# Altium schematic sheet JTAG.SchDoc
size A4
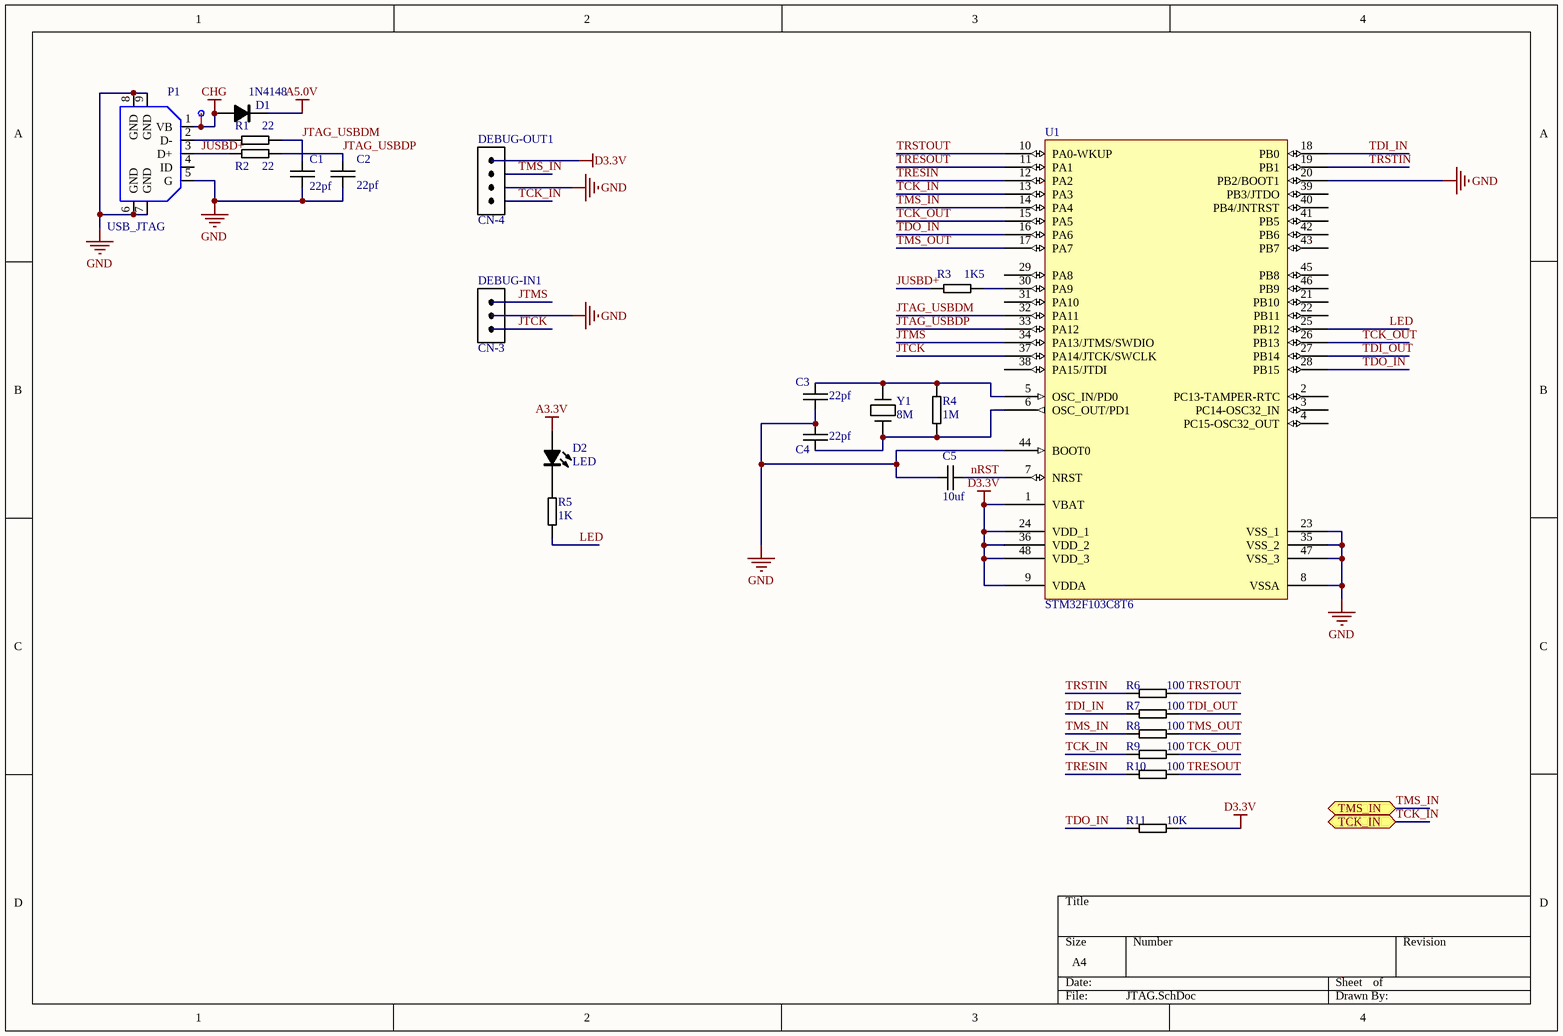
[diagram p0: JTAG.SchDoc]

## Parts
*1  Point  [Point]  (value not drawn)
C1  22pf  [0805-C]
C2  22pf  [0805-C]
C3  22pf  [0603]
C4  22pf  [0603]
C5  10uf  [0603]
D1  1N4148  [DO-35]
D2  LED  [0805-LED]
DEBUG-IN1  CN-3  [SIP-3]
DEBUG-OUT1  CN-4  [SIP-4]
P1  USB_JTAG  [USB_Mini_B]
R1  22  [0805-R]
R2  22  [0805-R]
R3  1K5  [0603]
R4  1M  [0603]
R5  1K  [0805-R]
R6  100  [0603]
R7  100  [0603]
R8  100  [0603]
R9  100  [0603]
R10  100  [0603]
R11  10K  [0603]
U1  STM32F103C8T6  [LQFP48_N]
Y1  8M  [XTAL(HC-49)]

## Ports
TCK_IN, TMS_IN

## Nets
A3.3V: D2.1(A)
A5.0V: D1.2(K)
CHG: *1.1(Point) D1.1(A) P1.1(VB)
D3.3V: DEBUG-OUT1.1 R11.2 U1.1(VBAT) U1.9(VDDA) U1.24(VDD_1) U1.36(VDD_2) U1.48(VDD_3)
GND: C1.2 C2.2 C3.2 C4.1 C5.1 DEBUG-IN1.2 DEBUG-OUT1.3 P1.5(G) P1.6(GND) P1.7(GND) P1.8(GND) P1.9(GND) U1.8(VSSA) U1.20(PB2/BOOT1) U1.23(VSS_1) U1.35(VSS_2) U1.44(BOOT0) U1.47(VSS_3)
JTAG_USBDM: C1.1 R1.2 U1.32(PA11)
JTAG_USBDP: C2.1 R2.2 U1.33(PA12)
JTCK: DEBUG-IN1.3 U1.37(PA14/JTCK/SWCLK)
JTMS: DEBUG-IN1.1 U1.34(PA13/JTMS/SWDIO)
JUSBD+: P1.3(D+) R2.1 R3.1
LED: R5.2 U1.25(PB12)
nRST: C5.2 U1.7(NRST)
TCK_IN: DEBUG-OUT1.4 R9.1 U1.13(PA3) ; port TCK_IN
TCK_OUT: R9.2 U1.15(PA5) U1.26(PB13)
TDI_IN: R7.1 U1.18(PB0)
TDI_OUT: R7.2 U1.27(PB14)
TDO_IN: R11.1 U1.16(PA6) U1.28(PB15)
TMS_IN: DEBUG-OUT1.2 R8.1 U1.14(PA4) ; port TMS_IN
TMS_OUT: R8.2 U1.17(PA7)
TRESIN: R10.1 U1.12(PA2)
TRESOUT: R10.2 U1.11(PA1)
TRSTIN: R6.1 U1.19(PB1)
TRSTOUT: R6.2 U1.10(PA0-WKUP)
NetC3_1: C3.1 R4.1 U1.5(OSC_IN/PD0) Y1.1
NetC4_2: C4.2 R4.2 U1.6(OSC_OUT/PD1) Y1.2
NetD2_2: D2.2(K) R5.1
NetP1_2: P1.2(D-) R1.1
NetR3_2: R3.2 U1.30(PA9)

Not connected (* = marked no-connect by the designer): P1 4(ID); U1 2(PC13-TAMPER-RTC) 3(PC14-OSC32_IN) 4(PC15-OSC32_OUT) 21(PB10) 22(PB11) 29(PA8) 31(PA10) 38(PA15/JTDI) 39(PB3/JTDO) 40(PB4/JNTRST) 41(PB5) 42(PB6) 43(PB7) 45(PB8) 46(PB9)

## Library data of the parts
C1-C5 = CAP_Chip: 贴片
D1 = 1N4148(DO-35): 1.04.08.0001
D2 = LED: 贴片
P1 = USB_Mini_B
R1-R11 = RES_Chip: 贴片
U1 = STM32F103C8T6: STM32 ARM-based 32-bit MCU with 64 Kbytes Flash, 48-pin LQFP, Industrial Temperature; Published: 30-May-2008; DatasheetVersion: rev6, Mar-2008; PackageVersion: Mar-2008; PackageReference: LQFP48; Publisher: Altium Limited; PackageDescription: 48-Pin Low-Profile Quad Flat Pack, 7 x 7 mm Body, 0.5 mm Pitch (LQFP48); ComponentLink1Description: Manufacturer Link; ComponentLink1URL: www.st.com/stm32; ComponentLink2Description: Datasheet; ComponentLink2URL: http://www.st.com/stonline/products/literature/ds/13587.pdf
Y1 = XTAL(12.000M,HC-49US): 1.07.02.0011